# Altium schematic sheet PowerSupply.SchDoc: =ProjectDescription
size 297 x 209 mm; Address1: Address1; Address2: Address2; Address3: Address3; Address4: Address4; SheetNumber: 1; SheetTotal: 7; Scale: 1:1; DocumentType: Схема электрическая принципиальная
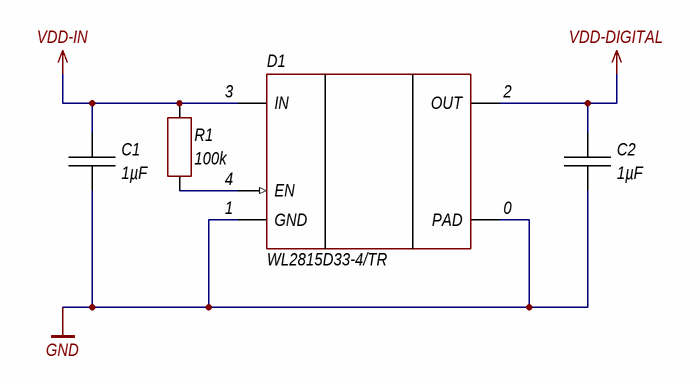
[diagram p0: PowerSupply.SchDoc]

## Parts
C1  1µF  [CH0402C]
C2  1µF  [CH0402C]
D1  WL2815D33-4/TR  [DFN1010-4]
R1  100k  [CH0402R]

## Nets
GND: C1.1 C2.1 D1.0(PAD) D1.1(GND)
VDD-DIGITAL: C2.2 D1.2(OUT)
VDD-IN: C1.2 D1.3(IN) R1.2
NetD1_4: D1.4(EN) R1.1

## Notes on the sheet
- Утв.
- Н.контр.
- Т.контр.
- Пров.
- Разраб.
- Изм.
- Лист
- № докум.
- Подп.
- Дата
- Копировал
- Формат А4
- Лит.
- Листов
- Масса
- Масштаб

## Library data of the parts
C1 C2 = Capacitor: Manufacturer: *; Model: *; HelpURL: *; ComponentKind: *; Value: 1µF
D1 = WL2815: LDO; Model: WL2815D33-4/TR; HelpURL: https://www.lcsc.com/product-detail/Linear-Voltage-Regulators-LDO_WILLSEMI-Will-Semicon-WL2815D33-4-TR_C506126.html; ComponentKind: DFN1010-4, 5.25V, 300mA
R1 = Resistor: Manufacturer: *; Model: *; HelpURL: *; ComponentKind: *; Value: 100k